# Altium project EA3036C.PrjPcb
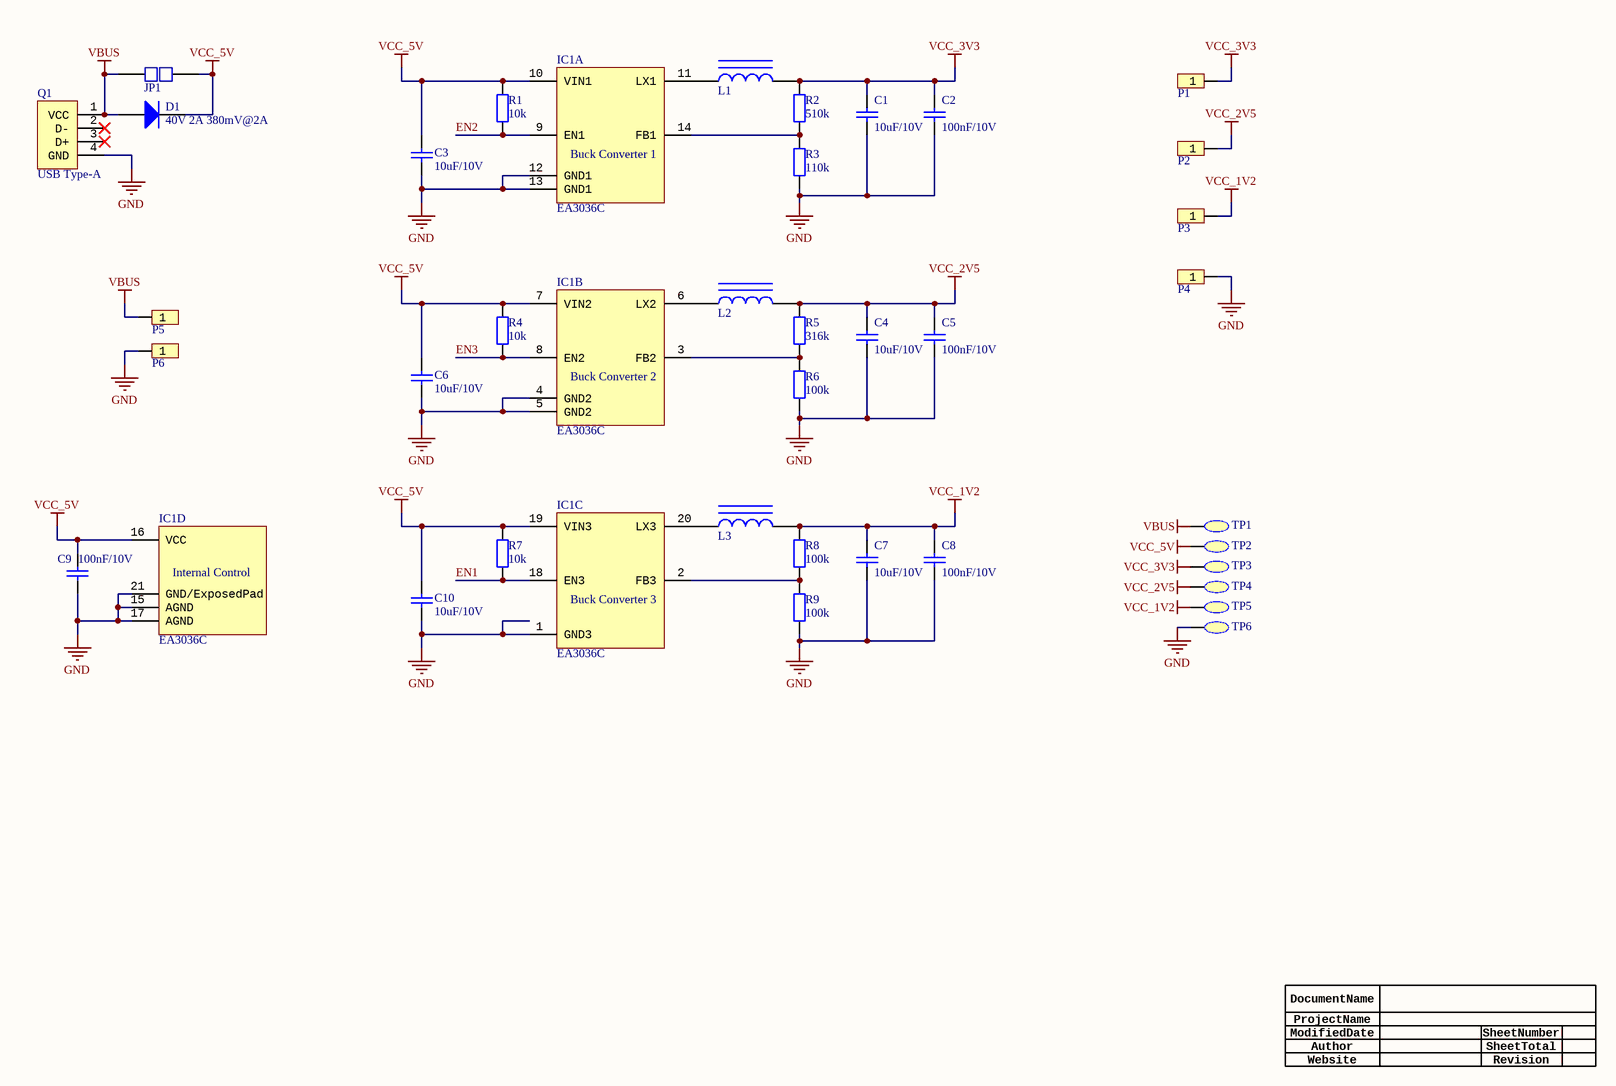
[diagram p0: EA3036C.SchDoc]
1 sheet, 38 parts. Net scope: global (net labels, ports and power ports of the same name join across sheets).
Board file: EA3036C.PcbDoc

## Sheet EA3036C.SchDoc
size A3; Author: Power Lin; SheetNumber: 1; SheetTotal: 1; Website: wiki-power.com

### Parts
C1  10uF/10V  [CAP-0402]
C2  100nF/10V  [CAP-0402]
C3  10uF/10V  [CAP-0402]
C4  10uF/10V  [CAP-0402]
C5  100nF/10V  [CAP-0402]
C6  10uF/10V  [CAP-0402]
C7  10uF/10V  [CAP-0402]
C8  100nF/10V  [CAP-0402]
C9  100nF/10V  [CAP-0402]
C10  10uF/10V  [CAP-0402]
D1  40V 2A 380mV@2A  [SOD_123]
IC1  EA3036C  [QFN3mmx3mm-20]  (parts A,B,C,D of 4)
JP1  Select  [选择焊点-0402]  (value not drawn)
L1  10uH  [L-2520]  (value not drawn)
L2  10uH  [L-2520]  (value not drawn)
L3  10uH  [L-2520]  (value not drawn)
P1  HDR1x2_2.54  [HDR1X1_2.54]  (value not drawn)
P2  HDR1x2_2.54  [HDR1X1_2.54]  (value not drawn)
P3  HDR1x2_2.54  [HDR1X1_2.54]  (value not drawn)
P4  HDR1x2_2.54  [HDR1X1_2.54]  (value not drawn)
P5  HDR1x2_2.54  [HDR1X1_2.54]  (value not drawn)
P6  HDR1x2_2.54  [HDR1X1_2.54]  (value not drawn)
Q1  USB Type-A  [USB-A-male]
R1  10k  [R-0402]
R2  510k  [R-0402]
R3  110k  [R-0402]
R4  10k  [R-0402]
R5  316k  [R-0402]
R6  100k  [R-0402]
R7  10k  [R-0402]
R8  100k  [R-0402]
R9  100k  [R-0402]
TP1  TestPoint  [TestPoint]  (value not drawn)
TP2  TestPoint  [TestPoint]  (value not drawn)
TP3  TestPoint  [TestPoint]  (value not drawn)
TP4  TestPoint  [TestPoint]  (value not drawn)
TP5  TestPoint  [TestPoint]  (value not drawn)
TP6  TestPoint  [TestPoint]  (value not drawn)

### Nets
GND: C1.1 C2.1 C3.1 C4.1 C5.1 C6.1 C7.1 C8.1 C9.1 C10.1 IC1.1(GND3) IC1.4(GND2) IC1.5(GND2) IC1.12(GND1) IC1.13(GND1) IC1.15(AGND) IC1.17(AGND) IC1.21(GND/ExposedPad) P4.1 P6.1 Q1.4(GND) R3.1 R6.1 R9.1 TP6.1
VBUS: D1.1(A) JP1.1 P5.1 Q1.1(VCC) TP1.1
VCC_1V2: C7.2 C8.2 L3.2 P3.1 R8.2 TP5.1
VCC_2V5: C4.2 C5.2 L2.2 P2.1 R5.2 TP4.1
VCC_3V3: C1.2 C2.2 L1.2 P1.1 R2.2 TP3.1
VCC_5V: C3.2 C6.2 C9.2 C10.2 D1.2(K) IC1.7(VIN2) IC1.10(VIN1) IC1.16(VCC) IC1.19(VIN3) JP1.2 R1.2 R4.2 R7.2 TP2.1
EN1: IC1.18(EN3) R7.1
EN2: IC1.9(EN1) R1.1
EN3: IC1.8(EN2) R4.1
NetIC1_2: IC1.2(FB3) R8.1 R9.2
NetIC1_3: IC1.3(FB2) R5.1 R6.2
NetIC1_6: IC1.6(LX2) L2.1
NetIC1_11: IC1.11(LX1) L1.1
NetIC1_14: IC1.14(FB1) R2.1 R3.2
NetIC1_20: IC1.20(LX3) L3.1

Not connected (* = marked no-connect by the designer): Q1 2(D-)* 3(D+)*

### Notes on the sheet
- Author
- DocumentName
- ModifiedDate
- ProjectName
- SheetNumber
- SheetTotal
- Website
- Revision
- (in symbol EA3036C, part A) Buck Converter 1
- (in symbol EA3036C, part B) Buck Converter 2
- (in symbol EA3036C, part C) Buck Converter 3
- (in symbol EA3036C, part D) Internal Control

### Library data of the parts
C1 C3 C4 C6 C7 C10 = CAP: CC0402MRX5R6BB106(±20%); ComponentLink1Description: 供应商链接; ComponentLink1URL: http://www.szlcsc.com/product/details_53938.html; Package: 0402; Supplier: LC; SuppliersPartNumber: C52923
C2 C5 C8 C9 = CAP: CC0402KRX5R6BB104(±10%); ComponentLink1Description: 供应商链接; ComponentLink1URL: http://www.szlcsc.com/product/details_53938.html; Package: 0402; Supplier: LC; SuppliersPartNumber: C52923
D1 = DIODE: PSBD1DF40V2L; ComponentLink1Description: 供应商链接; ComponentLink1URL: http://www.szlcsc.com/product/details_23178.html; Package: SMA(DO-214AC); Supplier: LC; SuppliersPartNumber: C22452
IC1 = EA3036C: EA3036 is a 3CH power management IC for applications powered by one Li-Ion battery or a DC 5V adapter.
JP1 = Select: 选择焊点
L1-L3 = INDUCTOR: 电感; ComponentLink1Description: 供应商链接; ComponentLink1URL: http://www.szlcsc.com/product/details_33003.html; Package: 0402; Supplier: LC; SuppliersPartNumber: C32041
P1-P6 = HDR1x1_2.54: Header
Q1 = USB A: U217-041N-4BV81
R1 R4 R7 = RES: RC0402FR-0710KL; Package: 0805; Supplier: LC; SuppliersPartNumber: C17798
R2 R3 = RES: RC0402FR-07510KL; Package: 0805; Supplier: LC; SuppliersPartNumber: C17798
R5 = RES: RC0402FR-07316KL; Package: 0805; Supplier: LC; SuppliersPartNumber: C17798
R6 R8 R9 = RES: RC0402FR-07100KL; Package: 0805; Supplier: LC; SuppliersPartNumber: C17798
TP1-TP6 = TestPoint: 测试点